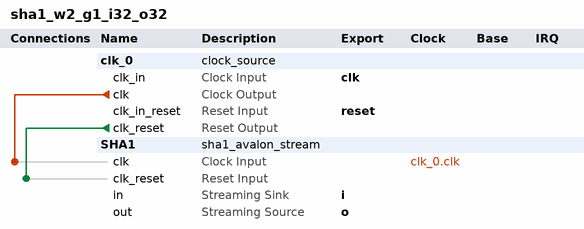
[diagram p0: system contents]
# Platform Designer (Qsys) system sha1_w2_g1_i32_o32
# Parameters at their usual value, and those the tool derives, are not listed.
package require -exact qsys 11.1
create_system sha1_w2_g1_i32_o32
set_project_property DEVICE_FAMILY STINGRAY

add_instance clk_0 clock_source 11.1
set_instance_parameter_value clk_0 clockFrequency 50000000

add_instance SHA1 sha1_avalon_stream 11.1
set_instance_parameter_value SHA1 I_BYTES 4
set_instance_parameter_value SHA1 O_BYTES 4
set_instance_parameter_value SHA1 WORDS 2
set_instance_parameter_value SHA1 BLOCK_GAP 1

# connections
add_connection clk_0.clk SHA1.clk clock
add_connection clk_0.clk_reset SHA1.clk_reset reset

# exported interfaces
add_interface clk clock sink
set_interface_property clk EXPORT_OF clk_0.clk_in
add_interface reset reset sink
set_interface_property reset EXPORT_OF clk_0.clk_in_reset
add_interface i avalon_streaming sink
set_interface_property i EXPORT_OF SHA1.in
add_interface o avalon_streaming source
set_interface_property o EXPORT_OF SHA1.out

save_system sha1_w2_g1_i32_o32.qsys
